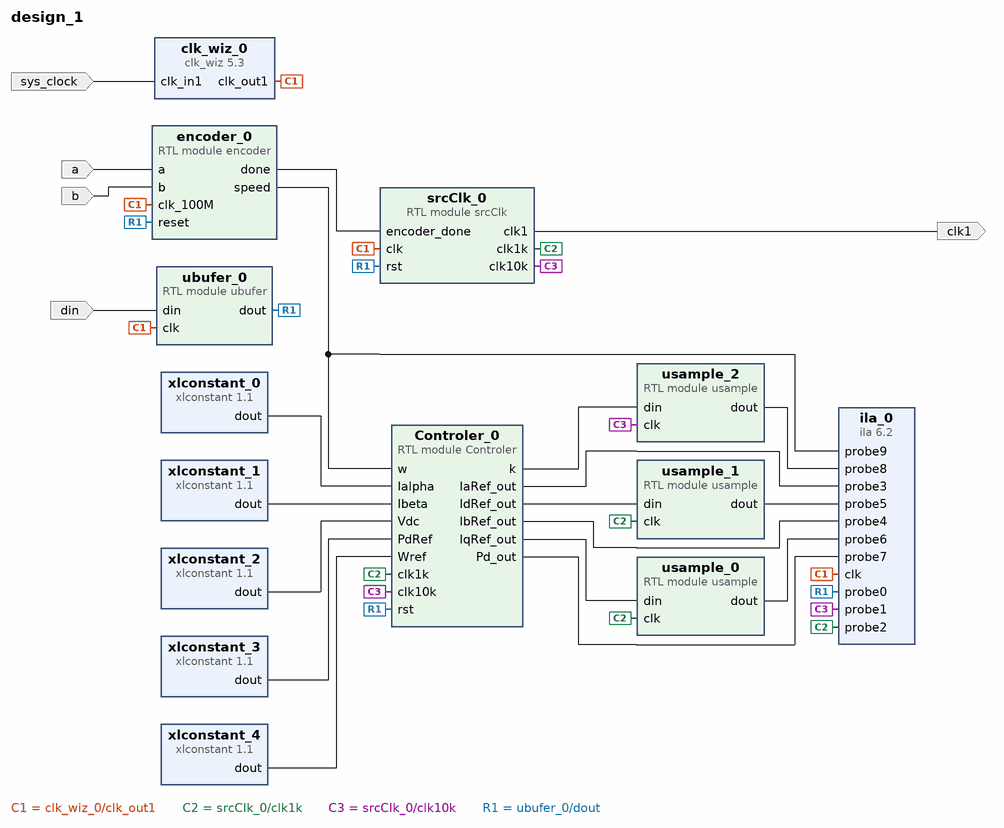
[diagram p0: block diagram of the top level]
# Vivado block design design_1, xc7z020clg400-1, Vivado 2016.4
create_bd_design design_1

create_bd_port -dir I a
create_bd_port -dir I b
create_bd_port -dir I -type clk sys_clock
set_property -dict {CONFIG.FREQ_HZ 125000000 CONFIG.PHASE 0.000} [get_bd_ports sys_clock]
create_bd_port -dir I din
create_bd_port -dir O clk1

create_bd_cell -type module -reference encoder encoder_0
create_bd_cell -type ip -vlnv xilinx.com:ip:ila:6.2 ila_0
set_property -dict [list \
  CONFIG.C_PROBE9_TYPE 1 \
  CONFIG.C_PROBE8_TYPE 1 \
  CONFIG.C_PROBE7_TYPE 1 \
  CONFIG.C_PROBE6_TYPE 1 \
  CONFIG.C_PROBE5_TYPE 1 \
  CONFIG.C_PROBE4_TYPE 1 \
  CONFIG.C_PROBE3_TYPE 1 \
  CONFIG.C_PROBE2_TYPE 0 \
  CONFIG.C_PROBE0_TYPE 2 \
  CONFIG.C_PROBE9_WIDTH 20 \
  CONFIG.C_PROBE8_WIDTH 16 \
  CONFIG.C_PROBE7_WIDTH 20 \
  CONFIG.C_PROBE6_WIDTH 20 \
  CONFIG.C_PROBE5_WIDTH 20 \
  CONFIG.C_PROBE4_WIDTH 20 \
  CONFIG.C_PROBE3_WIDTH 20 \
  CONFIG.C_NUM_OF_PROBES 10 \
  CONFIG.C_EN_STRG_QUAL 1 \
  CONFIG.C_PROBE7_MU_CNT 2 \
  CONFIG.C_PROBE6_MU_CNT 2 \
  CONFIG.C_PROBE5_MU_CNT 2 \
  CONFIG.C_PROBE4_MU_CNT 2 \
  CONFIG.C_PROBE3_MU_CNT 2 \
  CONFIG.C_PROBE2_MU_CNT 2 \
  CONFIG.C_PROBE1_MU_CNT 2 \
  CONFIG.C_PROBE0_MU_CNT 2 \
  CONFIG.ALL_PROBE_SAME_MU_CNT 2 \
  CONFIG.C_ENABLE_ILA_AXI_MON false \
  CONFIG.C_MONITOR_TYPE Native \
] [get_bd_cells ila_0]
create_bd_cell -type module -reference Controler Controler_0
create_bd_cell -type ip -vlnv xilinx.com:ip:xlconstant:1.1 xlconstant_0
set_property -dict {CONFIG.CONST_WIDTH 20 CONFIG.CONST_VAL 1000} [get_bd_cells xlconstant_0]
create_bd_cell -type ip -vlnv xilinx.com:ip:xlconstant:1.1 xlconstant_1
set_property -dict {CONFIG.CONST_WIDTH 20 CONFIG.CONST_VAL 0600} [get_bd_cells xlconstant_1]
create_bd_cell -type ip -vlnv xilinx.com:ip:xlconstant:1.1 xlconstant_2
set_property -dict {CONFIG.CONST_WIDTH 20 CONFIG.CONST_VAL 1000} [get_bd_cells xlconstant_2]
create_bd_cell -type ip -vlnv xilinx.com:ip:xlconstant:1.1 xlconstant_3
set_property -dict {CONFIG.CONST_WIDTH 20 CONFIG.CONST_VAL 4850} [get_bd_cells xlconstant_3]
create_bd_cell -type ip -vlnv xilinx.com:ip:xlconstant:1.1 xlconstant_4
set_property -dict {CONFIG.CONST_WIDTH 20 CONFIG.CONST_VAL 0} [get_bd_cells xlconstant_4]
create_bd_cell -type ip -vlnv xilinx.com:ip:clk_wiz:5.3 clk_wiz_0
set_property -dict [list \
  CONFIG.CLKIN1_JITTER_PS 80.0 \
  CONFIG.USE_LOCKED false \
  CONFIG.USE_RESET false \
  CONFIG.MMCM_DIVCLK_DIVIDE 1 \
  CONFIG.MMCM_CLKFBOUT_MULT_F 8.000 \
  CONFIG.MMCM_CLKIN1_PERIOD 8.0 \
  CONFIG.USE_BOARD_FLOW true \
  CONFIG.CLK_IN1_BOARD_INTERFACE sys_clock \
  CONFIG.CLKOUT1_JITTER 124.615 \
  CONFIG.CLKOUT1_PHASE_ERROR 96.948 \
] [get_bd_cells clk_wiz_0]
create_bd_cell -type module -reference ubufer ubufer_0
create_bd_cell -type module -reference srcClk srcClk_0
create_bd_cell -type module -reference usample usample_0
create_bd_cell -type module -reference usample usample_1
create_bd_cell -type module -reference usample usample_2
set_property -dict {CONFIG.dWidth 16} [get_bd_cells usample_2]

# ---- connections ----

connect_bd_net [get_bd_pins encoder_0/speed] [get_bd_pins Controler_0/w] [get_bd_pins ila_0/probe9]
connect_bd_net [get_bd_ports a] [get_bd_pins encoder_0/a]
connect_bd_net [get_bd_ports b] [get_bd_pins encoder_0/b]
connect_bd_net [get_bd_pins Controler_0/IaRef_out] [get_bd_pins ila_0/probe3]
connect_bd_net [get_bd_pins Controler_0/IbRef_out] [get_bd_pins ila_0/probe4]
connect_bd_net [get_bd_pins Controler_0/Pd_out] [get_bd_pins ila_0/probe7]
connect_bd_net [get_bd_pins xlconstant_0/dout] [get_bd_pins Controler_0/Ialpha]
connect_bd_net [get_bd_pins xlconstant_1/dout] [get_bd_pins Controler_0/Ibeta]
connect_bd_net [get_bd_pins xlconstant_2/dout] [get_bd_pins Controler_0/Vdc]
connect_bd_net [get_bd_pins xlconstant_3/dout] [get_bd_pins Controler_0/PdRef]
connect_bd_net [get_bd_pins xlconstant_4/dout] [get_bd_pins Controler_0/Wref]
connect_bd_net [get_bd_ports sys_clock] [get_bd_pins clk_wiz_0/clk_in1]
connect_bd_net [get_bd_pins clk_wiz_0/clk_out1] \
  [get_bd_pins encoder_0/clk_100M] [get_bd_pins ila_0/clk] [get_bd_pins ubufer_0/clk] [get_bd_pins srcClk_0/clk]
connect_bd_net [get_bd_pins encoder_0/done] [get_bd_pins srcClk_0/encoder_done]
connect_bd_net [get_bd_pins srcClk_0/clk1k] \
  [get_bd_pins Controler_0/clk1k] [get_bd_pins ila_0/probe2] [get_bd_pins usample_1/clk] [get_bd_pins usample_0/clk]
connect_bd_net [get_bd_pins srcClk_0/clk10k] [get_bd_pins Controler_0/clk10k] [get_bd_pins ila_0/probe1] [get_bd_pins usample_2/clk]
connect_bd_net [get_bd_ports din] [get_bd_pins ubufer_0/din]
connect_bd_net [get_bd_pins ubufer_0/dout] \
  [get_bd_pins encoder_0/reset] [get_bd_pins Controler_0/rst] [get_bd_pins ila_0/probe0] [get_bd_pins srcClk_0/rst]
connect_bd_net [get_bd_pins srcClk_0/clk1] [get_bd_ports clk1]
connect_bd_net [get_bd_pins Controler_0/IqRef_out] [get_bd_pins usample_0/din]
connect_bd_net [get_bd_pins Controler_0/IdRef_out] [get_bd_pins usample_1/din]
connect_bd_net [get_bd_pins Controler_0/k] [get_bd_pins usample_2/din]
connect_bd_net [get_bd_pins usample_2/dout] [get_bd_pins ila_0/probe8]
connect_bd_net [get_bd_pins usample_1/dout] [get_bd_pins ila_0/probe5]
connect_bd_net [get_bd_pins usample_0/dout] [get_bd_pins ila_0/probe6]

validate_bd_design
save_bd_design
